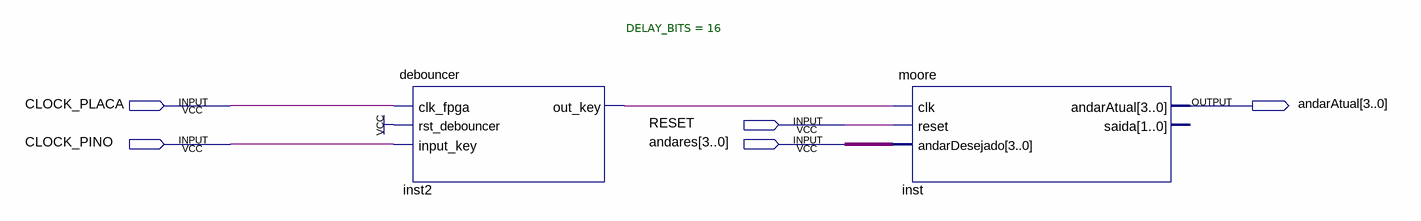
[diagram p0: schematic sheet]
// Quartus schematic elevadorFPGA.bdf as structural Verilog: 2 symbols, 5 pins
module elevadorFPGA (
  input  CLOCK_PLACA,
  input  RESET,
  input  CLOCK_PINO,
  input  [3:0] andares,
  output [3:0] andarAtual
);

  wire inst2_out_key;

  debouncer #(.DELAY_BITS(16)) inst2 (
    .clk_fpga(CLOCK_PLACA), .rst_debouncer(1'b1), .input_key(CLOCK_PINO), .out_key(inst2_out_key));
  moore inst (.clk(inst2_out_key), .reset(RESET), .andarDesejado(andares), .andarAtual(andarAtual));  // open: saida
endmodule
